# EAGLE schematic IOIO Unrouted (EAGLE 5.11)
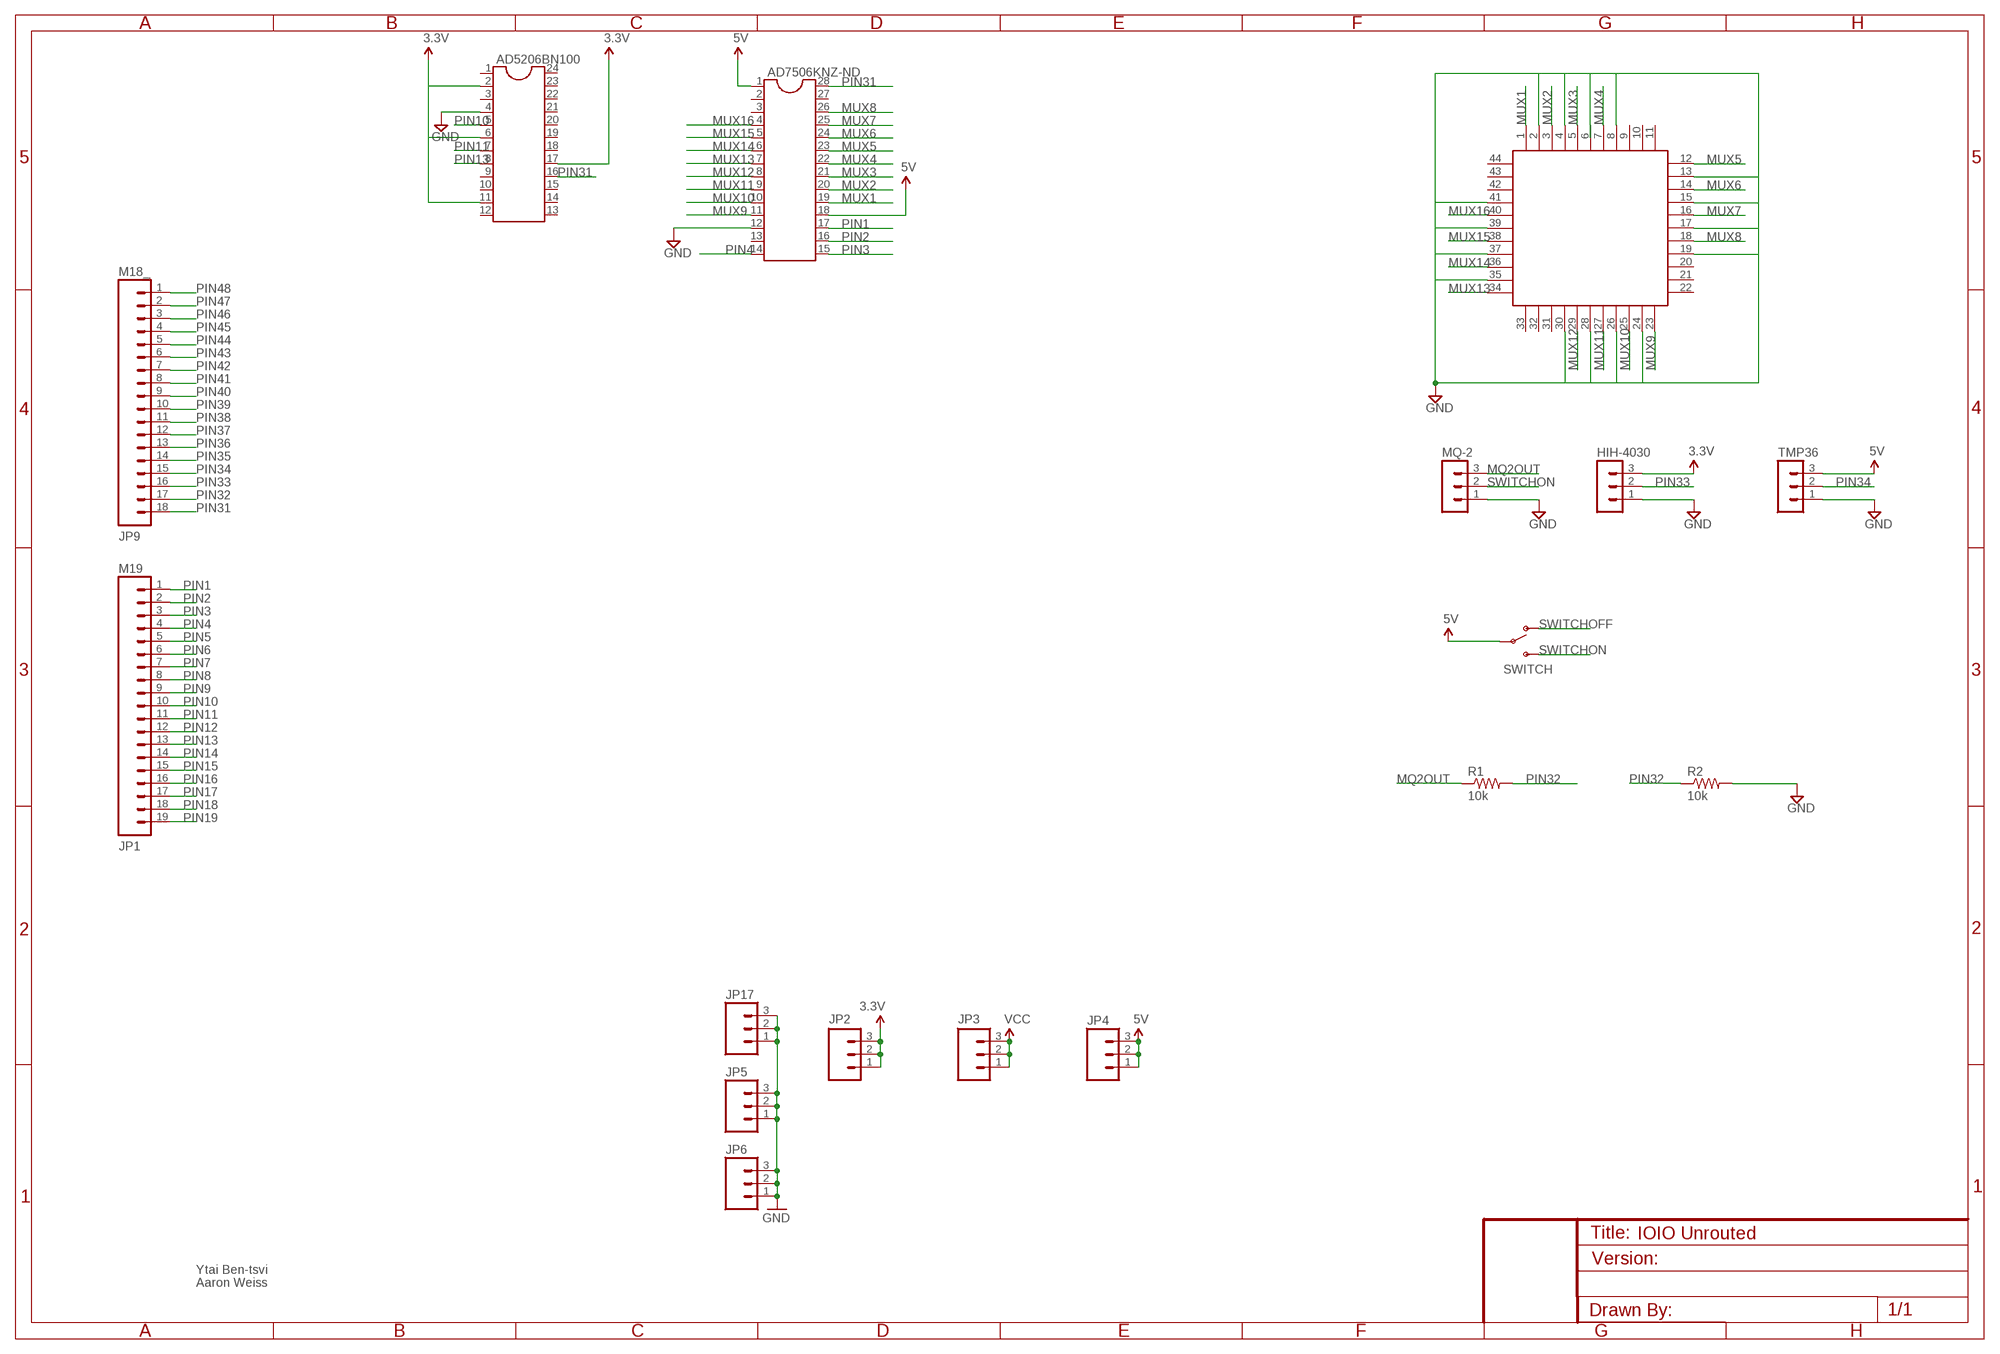
[diagram p0: schematic, sheet 1]

## Parts
AD5206BN100  DIL24-3  [DIL24-3]
AD7506KNZ-ND  DIL28  [DIL28-6]
HIH-4030  MA03-1  [MA03-1]
JP1  M19  [1X19]
JP2  M03PTH  [1X03]
JP3  M03PTH  [1X03]
JP4  M03PTH  [1X03]
JP5  M03PTH  [1X03]
JP6  M03PTH  [1X03]
JP9  M18_  [1X18]
JP17  M03PTH  [1X03]
MQ-2  MA03-1  [MA03-1]
R1  10k  R-US_0207/7  [0207/7]
R2  10k  R-US_0207/7  [0207/7]
SWITCH  SWITCH-SPSTPTH  [SWITCH-SPDT]
TMP36  MA03-1  [MA03-1]
U$1  S44  [S44]

## Nets
3.3V: AD5206BN100.2 AD5206BN100.6 AD5206BN100.11 AD5206BN100.17 HIH-4030.3 JP2.1 JP2.2 JP2.3
5V: AD7506KNZ-ND.1 AD7506KNZ-ND.18 JP4.1 JP4.2 JP4.3 SWITCH.2(P) TMP36.3
GND: AD5206BN100.4 AD7506KNZ-ND.12 HIH-4030.1 JP5.1 JP5.2 JP5.3 JP6.1 JP6.2 JP6.3 JP17.1 JP17.2 JP17.3 MQ-2.1 R2.2 TMP36.1 U$1.2 U$1.4 U$1.8 U$1.13 U$1.15 U$1.17 U$1.19 U$1.24 U$1.26 U$1.28 U$1.30 U$1.35 U$1.37 U$1.39 U$1.41
MQ2OUT: MQ-2.3 R1.1
MUX1: AD7506KNZ-ND.19 U$1.1
MUX2: AD7506KNZ-ND.20 U$1.3
MUX3: AD7506KNZ-ND.21 U$1.5
MUX4: AD7506KNZ-ND.22 U$1.7
MUX5: AD7506KNZ-ND.23 U$1.12
MUX6: AD7506KNZ-ND.24 U$1.14
MUX7: AD7506KNZ-ND.25 U$1.16
MUX8: AD7506KNZ-ND.26 U$1.18
MUX9: AD7506KNZ-ND.11 U$1.23
MUX10: AD7506KNZ-ND.10 U$1.25
MUX11: AD7506KNZ-ND.9 U$1.27
MUX12: AD7506KNZ-ND.8 U$1.29
MUX13: AD7506KNZ-ND.7 U$1.34
MUX14: AD7506KNZ-ND.6 U$1.36
MUX15: AD7506KNZ-ND.5 U$1.38
MUX16: AD7506KNZ-ND.4 U$1.40
PIN1: AD7506KNZ-ND.17 JP1.1
PIN2: AD7506KNZ-ND.16 JP1.2
PIN3: AD7506KNZ-ND.15 JP1.3
PIN4: AD7506KNZ-ND.14 JP1.4
PIN5: JP1.5
PIN6: JP1.6
PIN7: JP1.7
PIN8: JP1.8
PIN9: JP1.9
PIN10: AD5206BN100.5 JP1.10
PIN11: AD5206BN100.7 JP1.11
PIN12: JP1.12
PIN13: AD5206BN100.8 JP1.13
PIN14: JP1.14
PIN15: JP1.15
PIN16: JP1.16
PIN17: JP1.17
PIN18: JP1.18
PIN19: JP1.19
PIN31: AD5206BN100.16 AD7506KNZ-ND.28 JP9.18
PIN32: JP9.17 R1.2 R2.1
PIN33: HIH-4030.2 JP9.16
PIN34: JP9.15 TMP36.2
PIN35: JP9.14
PIN36: JP9.13
PIN37: JP9.12
PIN38: JP9.11
PIN39: JP9.10
PIN40: JP9.9
PIN41: JP9.8
PIN42: JP9.7
PIN43: JP9.6
PIN44: JP9.5
PIN45: JP9.4
PIN46: JP9.3
PIN47: JP9.2
PIN48: JP9.1
SWITCHOFF: SWITCH.1(O)
SWITCHON: MQ-2.2 SWITCH.3(S)
VCC: JP3.1 JP3.2 JP3.3
Unconnected: AD5206BN100.1 AD5206BN100.3 AD5206BN100.9 AD5206BN100.10 AD5206BN100.12 AD5206BN100.13 AD5206BN100.14 AD5206BN100.15 AD5206BN100.18 AD5206BN100.19 AD5206BN100.20 AD5206BN100.21 AD5206BN100.22 AD5206BN100.23 AD5206BN100.24 AD7506KNZ-ND.2 AD7506KNZ-ND.3 AD7506KNZ-ND.13 AD7506KNZ-ND.27 U$1.6 U$1.9 U$1.10 U$1.11 U$1.20 U$1.21 U$1.22 U$1.31 U$1.32 U$1.33 U$1.42 U$1.43 U$1.44

## Notes on the sheet
- Ytai Ben-tsvi
- Aaron Weiss

## Library data of the parts
AD5206BN100 = ic-package:DIL24: Dual In Line
AD7506KNZ-ND = ic-package:DIL28: Dual In Line
HIH-4030 MQ-2 TMP36 = con-lstb:MA03-1: PIN HEADER; OC_FARNELL: unknown; OC_NEWARK: unknown
JP1 = SparkFun:M19
JP2-JP6 JP17 = SparkFun:M03: Header 3 Standard 3-pin 0.1" header. Use with straight break away headers (SKU : PRT-00116), right angle break away headers (PRT-00553), swiss pins (PRT-00743), machine pins (PRT-00117), and female headers (PRT-00115). Molex polarized connector foot print use with SKU : PRT-08232 with associated crimp pins and housings.
JP9 = SparkFun:M18
R1 R2 = rcl:R-US_: RESISTOR, American symbol
SWITCH = SparkFun:SWITCH-SPST: SPST Switch Simple slide switch. Spark Fun Electronics SKU : COM-00102
U$1 = plcc-socket:S44: 44-pin PLCC through-hole socket